# Altium project PCB_ONBOARDING.PrjPcb
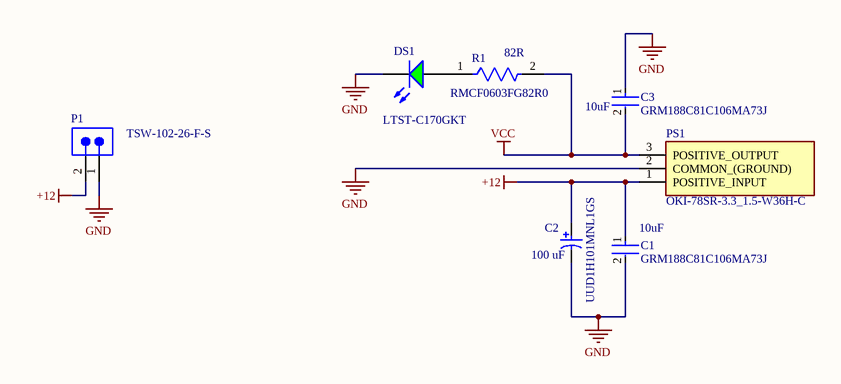
[diagram p0: Power.SchDoc]
2 sheets, 26 parts. Net scope: flat (ports and power ports of the same name join across sheets).
Board file: PCB_layout.PcbDoc
Sheets:
  Power.SchDoc
  Decade_counter.SchDoc

## Sheet Power.SchDoc
size A4; SheetNumber: 1; SheetTotal: 2

### Parts
C1  GRM188C81C106MA73J  Capacitance: 10uF  [FP-GRM188-0_2-IPC_A]
C2  UUD1H101MNL1GS  Rated Capacitance: 100 uF  [NIC-CAPA2-8X10_V]
C3  GRM188C81C106MA73J  Capacitance: 10uF  [FP-GRM188-0_2-IPC_A]
DS1  LTST-C170GKT  [LTST-C170GKT_V]
P1  TSW-102-26-F-S  [SMTC-TSW-102-26-XX-S]
PS1  OKI-78SR-3.3_1.5-W36H-C  [OKI78SR3315W36HC]
R1  RMCF0603FG82R0  value 82R  [FP-RMCF0603-IPC_A]

### Nets
+12: C1.1 C2.1 P1.2 PS1.1(POSITIVE_INPUT)
GND: C1.2 C2.2 C3.1 DS1.2(K) P1.1 PS1.2(COMMON_(GROUND))
VCC: C3.2 PS1.3(POSITIVE_OUTPUT) R1.2
NetDS1_1: DS1.1(A) R1.1

### Library data of the parts
C1 C3 = CMP-06035-041220-1: Chip Multilayer Ceramic Capacitors for General Purpose, 0603, 10uF, X6S, 22%, 20%, 16V; Thickness: 0.039inch; Packaging: Tape and Reel; Tolerance: 20%; Min Operating Temperature: -55°C; Mount: Surface Mount; Dielectric: X6S; Case/Package: 0603; Package Quantity: 10000; Length: 0.063inch; Voltage Rating: 16V; Width: 0.031inch; Weight: 0.000222oz; Voltage Rating (DC): 16V; Max Operating Temperature: 105°C
C2 = CMP-0687-00073-1: Aluminum Electrolytic Capacitor, UD Series, Low Impedance, 100 uF, 50 V, + / - 20%, -55 to 105 degC, Chip Type, 8 x 10 mm D x L, Pb-Free, Reel; Manufacturer: Nichicon; Rated Ripple Current (at 100kHz): 300 mA; Tolerance Rated Capacitance: -20 to 20%; Packing: Dia382mm Reel; Impedance: 0.34 Ohm; Rated Voltage: 50 V; Endurance Time: 5000 h; Capacitance: 100µF; Voltage Rating: 50V; Lifetime @ Temp.: 5000 Hrs @ 105°C; Polarization: Polar; Ripple Current: 300mA; Surface Mount Land Size: 0.327" L x 0.327" W (8.30mm x 8.30mm); ComponentLink3Description: Package Specification; ComponentLink2Description: Datasheet; PackageReference: CAPAE-D8H10; RoHS: TRUE; Length: 10 mm; Mounting Technology: Surface Mount; PackageDescription: 2-Pin Surface Mount Device, Diameter 8 mm, Height 10 mm, Pitch 6.5 mm; DatasheetVersion: 08/2012; Diameter: 8 mm; ComponentLink3URL: http://products.nichicon.co.jp/en/pdf/XJA043/e-ud.pdf; ComponentLink1Description: Manufacturer URL; PartNumber: UUD1H101MNL1GS; ComponentLink2URL: http://products.nichicon.co.jp/en/pdf/XJA043/e-ud.pdf; ComponentLink1URL: http://www.nichicon.co.jp/; Supplier 1: Digi-Key; Supplier Part Number 1: 493-2306-1-ND; Manufacturer Part Number: UUD1H101MNL1GS; Category: Capacitors; Stock 1: 65948; Pricing 1: 1=0.92, 10=0.685, 25=0.5868, 50=0.5478, 100=0.4696, 250=0.43044 (CAD); Packaging: Cut Tape (CT); Part Status: Active; Tolerance: ±20%; ESR (Equivalent Series Resistance): -; Operating Temperature: -55°C ~ 105°C; Applications: General Purpose; Lead Spacing: -; Size / Dimension: 0.315" Dia (8.00mm); Height - Seated (Max): 0.394" (10.00mm); Mounting Type: Surface Mount; Package / Case: Radial, Can - SMD; ComponentLink4URL: http://nichicon-us.com/english/products/pdfs/e-uud.pdf; ComponentLink4Description: http://nichicon-us.com/english/products/pdfs/e-uud.pdf
DS1 = CMP-1674-00002-5: LED Uni-Color Green, 100 mW, 120 mA, -55 to 85 degC, 2-Pin SMD, RoHS, Tape and Reel; Manufacturer: Lite-On; Lens Color: Colorless; Lens Transparency: Clear; Millicandela Rating: 6mcd; Lens Style/Size: Rectangle with Flat Top, 1.40mm x 1.25mm; Voltage - Forward (Vf) (Typ): 2.1V; Current - Test: 10mA; Viewing Angle: 130°; Wavelength - Dominant: 569nm; Wavelength - Peak: 565nm; ComponentLink1URL: http://www.us.liteon.com/; Height: 1.1 mm; PackageDescription: 2-Pin Surface Mount Device, Body 2 x 1.25 mm; RoHSCompliant: true; Package Quantity: 1; Packaging: Tape and Reel; Mount: Surface Mount; Min Operating Temperature: -55 degC; DatasheetVersion: 03/2003; Max Operating Temperature: 85 degC; ComponentLink1Description: Manufacturer URL; Pins: 2; Mounting Technology: Surface Mount; Length: 2 mm; Colour: Green; PackageReference: C170GKT; ComponentLink2URL: http://media.digikey.com/pdf/Data%20Sheets/Lite-On%20PDFs/LTST-C170GKT.pdf; ComponentLink2Description: Datasheet; Supplier 1: Digi-Key; Supplier Part Number 1: 160-1179-1-ND; Manufacturer Part Number: LTST-C170GKT; RoHS: RoHS Compliant; Category: Optoelectronics; Stock 1: 242288; Pricing 1: 1=0.48, 10=0.351, 25=0.2588, 100=0.1848, 250=0.12564, 500=0.11086, 1000=0.08684 (CAD); Part Status: Active; Color: Green; Mounting Type: Surface Mount; Features: -; Package / Case: 0805 (2012 Metric); Supplier Device Package: -; Size / Dimension: 2.00mm L x 1.25mm W; Height (Max): 1.10mm
P1 = CMP-1024-00329-1: 0.025" SQ Post Header, Through-hole, Vertical, -55 to 125 degC, 2.54 mm Pitch, 2-Pin, Male, RoHS; Manufacturer: Samtec; Pitch: 2.54 mm; PackageVersion: DM, 8/1988; ComponentLink2Description: Datasheet; PackageReference: TSW-102-26-XX-S; ComponentLink3URL: http://www.samtec.com/documents/webfiles/cpdf/TSW-XXX-XX-XXX-X-XX-XXX-MKT.pdf; ComponentLink2URL: http://www.samtec.com/documents/webfiles/pdf/TSW_TH.PDF; ComponentLink1Description: Manufacturer URL; DatasheetVersion: F-214; RoHS: True; ComponentLink3Description: Package Specification; PartNumber: TSW-102-26-F-S; Temperature Range: -55 to 125 degC; Orientation: Vertical; ComponentLink1URL: http://www.samtec.com; PackageDescription: .025[0.64] SQ. Post Terminal Strip Assembly; Mounting Technology: Through-hole
PS1 = OKI-78SR-3.3_1.5-W36H-C: Power Supply; Manufacturer_Name: Murata Electronics; Manufacturer_Part_Number: OKI-78SR-3.3/1.5-W36H-C; Datasheet Link: https://www.murata.com/products/productdata/8807037992990/oki-78sr.pdf?1675222286000; Height: 8.6mm; Mouser Part Number: 580-OKI78SR3.31.5WHC; Mouser Price/Stock: https://www.mouser.co.uk/ProductDetail/Murata-Power-Solutions/OKI-78SR-3.3-1.5-W36H-C?qs=2QmwSASSNhasLT4%252BJlpIag%3D%3D; Arrow Part Number: OKI-78SR-3.3/1.5-W36H-C; Arrow Price/Stock: https://www.arrow.com/en/products/oki-78sr-3.31.5-w36h-c/murata-power-solutions?utm_currency=USD&region=nac
R1 = CMP-26527-007395-1: 82Ω ±1% 0.1W 0603 Thick Film Chip Resistor AEC-Q200 compliant; RoHS Compliant: Yes

## Sheet Decade_counter.SchDoc
size A4; SheetNumber: 2; SheetTotal: 2
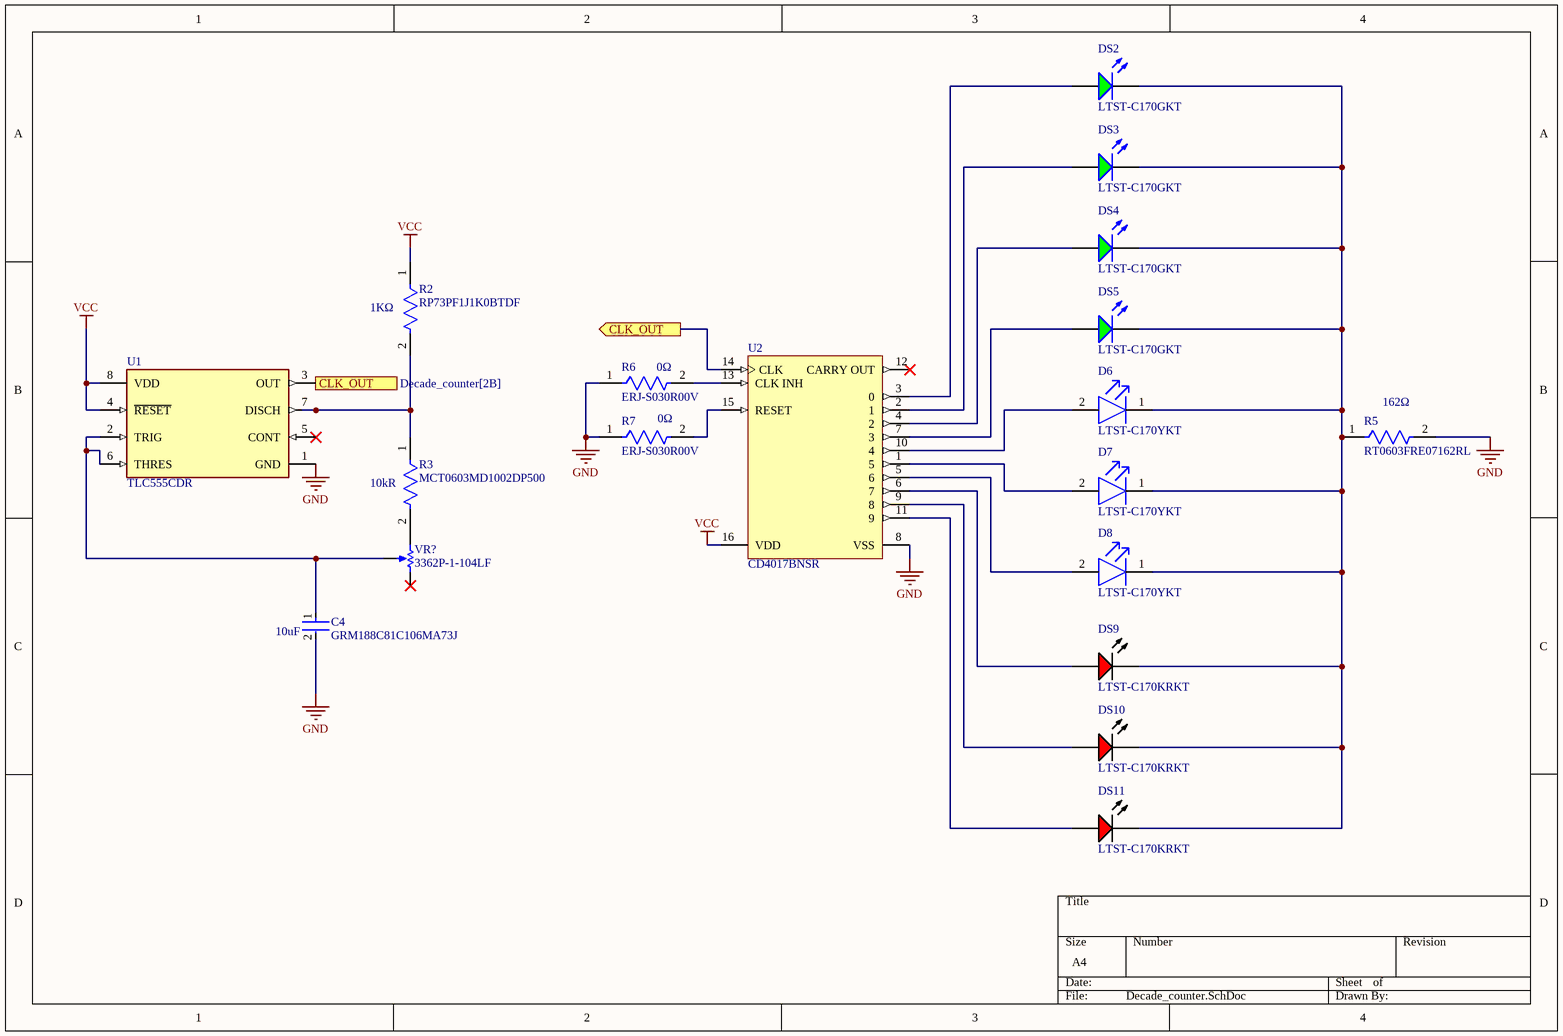
[diagram p1: Decade_counter.SchDoc]

### Parts
C4  GRM188C81C106MA73J  Capacitance: 10uF  [FP-GRM188-0_2-IPC_A]
D6  LTST-C170YKT  [FP-LTST-C170YKT-MFG]
D7  LTST-C170YKT  [FP-LTST-C170YKT-MFG]
D8  LTST-C170YKT  [FP-LTST-C170YKT-MFG]
DS2  LTST-C170GKT  [LTST-C170GKT_V]
DS3  LTST-C170GKT  [LTST-C170GKT_V]
DS4  LTST-C170GKT  [LTST-C170GKT_V]
DS5  LTST-C170GKT  [LTST-C170GKT_V]
DS9  LTST-C170KRKT  [LTST-C170KRKT_V]
DS10  LTST-C170KRKT  [LTST-C170KRKT_V]
DS11  LTST-C170KRKT  [LTST-C170KRKT_V]
R2  RP73PF1J1K0BTDF  value 1KΩ  [FP-RP73P-1J-MFG]
R3  MCT0603MD1002DP500  Resistance: 10kR  [FP-MCT0603-IPC_A]
R5  RT0603FRE07162RL  Resistance: 162Ω  [FP-RT0603-MFG]
R6  ERJ-S030R00V  Resistance: 0Ω  [FP-ERJS03-MFG]
R7  ERJ-S030R00V  Resistance: 0Ω  [FP-ERJS03-MFG]
U1  TLC555CDR  [FP-D0008A-IPC_B]
U2  CD4017BNSR  [NS0016A_M]
VR1  3362P-1-104LF  [BOUR-3362P]

### Ports
CLK_OUT (out), CLK_OUT (out, see Decade_counter[2B])

### Nets
GND: C4.2 R5.2 R6.1 R7.1 U1.1(GND) U2.8(VSS)
VCC: R2.1 U1.4(~{RESET}) U1.8(VDD) U2.16(VDD)
NetC4_1: C4.1 U1.2(TRIG) U1.6(THRES) VR1.2(S)
NetD6_1: D6.1(C) D7.1(C) D8.1(C) DS2.2(K) DS3.2(K) DS4.2(K) DS5.2(K) DS9.2(K) DS10.2(K) DS11.2(K) R5.1
NetD6_2: D6.2(A) U2.10(4)
NetD7_2: D7.2(A) U2.1(5)
NetD8_2: D8.2(A) U2.5(6)
NetDS2_1: DS2.1(A) U2.3(0)
NetDS3_1: DS3.1(A) U2.2(1)
NetDS4_1: DS4.1(A) U2.4(2)
NetDS5_1: DS5.1(A) U2.7(3)
NetDS9_1: DS9.1(A) U2.6(7)
NetDS10_1: DS10.1(A) U2.9(8)
NetDS11_1: DS11.1(A) U2.11(9)
NetR2_2: R2.2 R3.1 U1.7(DISCH)
NetR3_2: R3.2 VR1.1(CCW)
NetR6_2: R6.2 U2.13(CLK_INH)
NetR7_2: R7.2 U2.15(RESET)
NetU1_3: U1.3(OUT) U2.14(CLK) ; port CLK_OUT

Not connected (* = marked no-connect by the designer): U1 5(CONT)*; U2 12(CARRY_OUT)*; VR1 3(CW)*

### Library data of the parts
C4 = CMP-06035-041220-1: as C1 on sheet Power; Thickness: 0.039inch; Packaging: Tape and Reel; Tolerance: 20%; Min Operating Temperature: -55°C; Mount: Surface Mount; Dielectric: X6S; Case/Package: 0603; Package Quantity: 10000; Length: 0.063inch; Voltage Rating: 16V; Width: 0.031inch; Weight: 0.000222oz; Voltage Rating (DC): 16V; Max Operating Temperature: 105°C
D6-D8 = CMP-1674-00003-7: LED YELLOW CLEAR SMD; Viewing Angle: 130°; Luminous Intensity: 6mcd; Test Current: 10mA; Number of Elements: 1; Forward Current: 20mA; Forward Voltage: 2.1V; Reverse Voltage: 5V; Power Dissipation: 60mW; Lens Style: Diffused; Wavelength: 585nm; Lens Color: Colorless; Dominant Wavelength: 588nm; RoHS Compliant: Yes; Height: 1.1mm; Min Operating Temperature: -55°C; Max Operating Temperature: 85°C; Number of LEDs: 1; Mount: Surface Mount; Radiation Hardening: No; Illumination Color: Yellow; Length: 3.2mm; Series: CHIPLED 0805; Package Quantity: 1; Packaging: Tape and Reel; Color: Yellow; Depth: 1.6mm; Case/Package: 0805; Lens Transparency: Clear; Case Code (Imperial): 0805; Width: 1.25mm; Case Code (Metric): 2012; Lead Free: Lead Free; Power Rating: 60mW; Number of Pins: 2
DS2-DS5 = CMP-1674-00002-5: as DS1 on sheet Power; ComponentLink1URL: http://www.us.liteon.com/; Height: 1.1 mm; PackageDescription: 2-Pin Surface Mount Device, Body 2 x 1.25 mm; RoHSCompliant: true; Package Quantity: 1; Packaging: Tape and Reel; Mount: Surface Mount; Min Operating Temperature: -55 degC; DatasheetVersion: 03/2003; Max Operating Temperature: 85 degC; ComponentLink1Description: Manufacturer URL; Pins: 2; Mounting Technology: Surface Mount; Length: 2 mm; Colour: Green; PackageReference: C170GKT; ComponentLink2URL: http://media.digikey.com/pdf/Data%20Sheets/Lite-On%20PDFs/LTST-C170GKT.pdf; ComponentLink2Description: Datasheet; Supplier 1: Digi-Key; Supplier Part Number 1: 160-1179-1-ND; Manufacturer Part Number: LTST-C170GKT; RoHS: RoHS Compliant; Category: Optoelectronics; Stock 1: 242288; Pricing 1: 1=0.48, 10=0.351, 25=0.2588, 100=0.1848, 250=0.12564, 500=0.11086, 1000=0.08684 (CAD); Part Status: Active; Color: Green; Mounting Type: Surface Mount; Features: -; Package / Case: 0805 (2012 Metric); Supplier Device Package: -; Size / Dimension: 2.00mm L x 1.25mm W; Height (Max): 1.10mm
DS9-DS11 = CMP-2000-07593-1: LED Red, 75 mW, 54 mcd, -55 to 85 degC, 2-Pin SMD, RoHS, Tape and Reel; Manufacturer: Lite-On; Lens Transparency: Clear; Number of Elements: 1; Power Rating: 75mW; Luminous Intensity: 54mcd; Viewing Angle: 130degrees; Forward Current: 30mA; Wavelength: 639nm; Lens Style: Rectangular; Case\/Package: 0805; Test Current: 20mA; Dominant Wavelength: 631nm; Forward Voltage: 2V; Lens Colour: Colorless; Min Operating Temperature: -55degC; RoHSCompliant: True; Length: 3.2mm; Width: 1.25mm; Mount: SurfaceMount; Packaging: TapeandReel; Number of LEDs: 1; Radiation Hardening: No; Datasheet URL: http://optoelectronics.liteon.com/upload/download/DS-22-99-0150/LTST-C170KRKT.pdf; Datasheet Version: Rev. D, 11/2014; Case Code (Metric): 2012; Height: 1.1mm; Number of Pins: 2; Package Description: 2-Pin Surface Mount Device, Body 2 x 1.25 mm; Manufacturer URL: http://www.us.liteon.com/; Lead Free: LeadFree; Illumination Colour: Red; Colour: Red; Case Code (Imperial): 0805; Max Operating Temperature: 85degC; Power Dissipation: 75mW; Mounting Technology: SurfaceMount; Package Reference: C170KRKT; Package Quantity: 1; Depth: 1.6mm
R2 = CMP-03211-004517-1: RES SMD 1K OHM 0.1% 1/6W 0603; Manufacturer: TE Connectivity; Power Rating: 0.166W; Tolerance: 0.001; Temperature Coefficient: 25ppm/°C; Voltage Rating: 100V; Composition: Thin Film; Category: Res; Temperature Range High: +155°C; Device Class L1: Passive Components; Digikey Description: RES SMD 1K OHM 0.1% 1/6W 0603; Lead Free: Yes; RoHS: TRUE; Ipc Land Pattern Name: RESC15580X45; Automotive: No; Temperature: -55°C to +155°C; Height: 0.55mm; ComponentLink2URL: https://www.te.com/commerce/DocumentDelivery/DDEController?Action=srchrtrv&DocNm=1773272&DocType=DS&DocLang=English; Manufacturer Part Number: RP73PF1J1K0BTDF; Resistance: 1KΩ; ComponentLink2Description: Datasheet; Temperature Range Low: -55°C; Octopart: https://octopart.com/rp73pf1j1k0btdf-te+connectivity-45465729; Device Class L3: Chip SMD Resistors; Series: RP73P; Package: RP73P-1J; Device Class L2: Resistors
R3 = CMP-02407-010942-1: RES SMD 100 OHM 1% 1/8W 0603; Power Rating: 125mW; Tolerance: 0.5%; Temperature Coefficient: 25ppm/°C; Max Power Dissipation: 150mW; Voltage Rating: 75V; Case Code (Imperial): 0603; Case Code (Metric): 1608; Military Standard: Not; Lead Free: Lead Free; Max Operating Temperature: 175°C; Length: 1.55mm; Height: 0.022inch; Min Operating Temperature: -55°C; Width: 0.8mm; Package Quantity: 1; Contact Plating: Tin; Termination: Wraparound; Composition: Thin Film; Case/Package: 0603; Number of Terminations: 2; Depth: 0.85mm; Features: Automotive AEC-Q200; Mount: Surface Mount; Voltage Rating (DC): 75V; Packaging: Tape and Reel; REACH SVHC: No SVHC
R5 = CMP-03412-027968-1: RES SMD 162 OHM 1% 1/10W 0603; Manufacturer: Yageo; Temperature Coefficient: 50 ppm/°C; Power Rating: 0.1W; Voltage Rating: 75V; Tolerance: 0.01; Value: 162Ω; Device Class L2: Resistors; ComponentLink2Description: Datasheet; Lead Free: Yes; Manufacturer Part Number: RT0603FRE07162RL; ComponentLink2URL: http://www.yageo.com/documents/recent/PYu-RT_1-to-0.01_RoHS_L_9.pdf; Automotive: No; Ipc Land Pattern Name: RESC16080X45; Height: 0.55mm; Temperature Range High: +155°C; Category: Res; Footprint Url: http://www.yageo.com/exep/pages/download/literatures/PYu-R_Mount_10.pdf; Series: RT; Composition: Thin Film; Mouser Description: Thin Film Resistors - SMD 1/10W 162 ohm 1% 50ppm; Digikey Description: RES SMD 162 OHM 1% 1/10W 0603; Temperature Range Low: -55°C; Temperature: -55°C to +155°C; Package: RT0603; Device Class L1: Passive Components; Device Class L3: Chip SMD Resistors; RoHS: TRUE; Octopart: https://octopart.com/rt0603fre07162rl-yageo-1483634
R6 R7 = CMP-00287-39831190-1: ERJ-S030R00V Zero Ohm Resistor, Jumper, 0603 [1608 Metric], Thick Film, 100 mW, 1 A, Surface Mount; Voltage Rating (DC): 100V; Max Power Dissipation: 100mW; Temperature Coefficient: 100ppm/°C; Tolerance: 5%; Case Code (Metric): 1608; Case Code (Imperial): 0603; Width: 800µm; Min Operating Temperature: -55°C; Lifecycle Status: Production; Features: Anti-Sulfur; Case/Package: 0603; Number of Terminations: 2; Max Operating Temperature: 155°C; Length: 1.6mm; Mount: Surface Mount; NexarPartId: 39831190; Height: 558.8µm; RoHS: Compliant; Contact Plating: Tin; Power Rating: 100mW; Military Standard: Not; Depth: 800µm; Lead Free: Lead Free; Composition: Thick Film
U1 = CMP-04857-000001-1: IC OSC SGL TIMER 2.1MHZ 8-SOIC; Min Supply Voltage: 2V; Number of Channels: 1; Max Power Dissipation: 725mW; Max Supply Voltage: 15V; Low Level Output Current: 100mA; Current Rating: 250A; Quiescent Current: 250uA; Operating Supply Current: 360uA; High Level Output Current: -10mA; Width: 3.91mm; Case/Package: SOIC; Weight: 0.002561oz; Frequency: 2.1MHz; Height: 1.58mm; Package Quantity: 2500; REACH SVHC: No SVHC; Number of Timers/Counters: 1; Lead Free: Lead Free; Number of Pins: 8; Max Operating Temperature: 125°C; Min Operating Temperature: -40°C; Length: 4.9mm; Radiation Hardening: No; Packaging: Tape and Reel; Termination: SMD/SMT; Mount: Surface Mount; Power Dissipation: 725mW
U2 = CMP-1623-00606-2: CMOS Decade Counter with 10 Decoded Outputs, NS0016A, LARGE T&R; Manufacturer: Texas Instruments; F @ Nom Voltage(Max)(Mhz): 8; Output Drive (IOL/IOH)(Max)(mA): 1.5/-1.5; Bits(#): 10; ICC @ Nom Voltage(Max)(mA): 0.03; Technology Family: CD4000; Schmitt Trigger: No; VCC(Min)(V): 3; Inputs: 1; tpd @ Nom Voltage(Max)(ns): 270; VCC(Max)(V): 18; Rating: Military; Operating Temperature Range(C): -55 to 125; DatasheetVersion: SCHS027C; Input Type: CMOS; Voltage(Nom)(V): 10; PackageReference: NS0016A; Output Type: CMOS; Function: Counter; Type: Decade; Generic Part Number: CD4017B
VR1 = CMP-1747-00003-1: Square Trimpot(R) Trimming Potentiometer, 100 KOhm, 300 V, -55 to 125 degC, 3-Pin THD, RoHS, Tube; Voltage Rating: 250 V; Case\Package: Axial; Tolerance: 1%; Power Rating: 250 mW; Resistance: 1 mohm; RoHSCompliant: true; ComponentLink2URL: http://www.bourns.com/docs/Product-Datasheets/3362.pdf; ComponentLink1Description: Manufacturer URL; DatasheetVersion: May-16; Package Quantity: 200; ComponentLink2Description: Datasheet; Min Operating Temperature: -55 degC; Mount: Through Hole; PackageDescription: 3-Pin Through Hole Device, Body 6.6 x 6.99 mm, Pitch 2.54 mm; Length: 0.248 inch; ComponentLink1URL: http://www.bourns.com/; PackageReference: 3326P; Max Operating Temperature: 155 degC; Packaging: Bulk

## Nets that join several sheets
GND: Power (6 pins), Decade_counter (6 pins)
VCC: Power (C3.2 PS1.3 R1.2), Decade_counter (R2.1 U1.4 U1.8 U2.16)